# Altium schematic sheet power_REG104GA_3V3.SchDoc
size A4
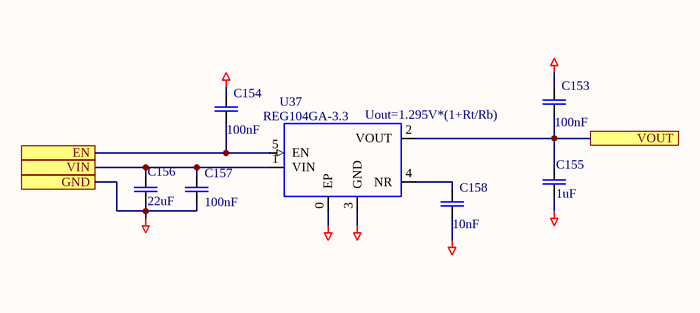
[diagram p0: power_REG104GA_3V3.SchDoc]

## Parts
C153  100nF  [CAPC1608N]
C154  100nF  [CAPC1608N]
C155  1uF  [CAPC2012N]
C156  22uF  [CAPC2012N]
C157  100nF  [CAPC1608N]
C158  10nF  [CAPC1608N]
U37  REG104GA-3.3  [SOT223]

## Ports
EN, GND, VIN, VOUT

## Nets
GND: C153.2 C154.2 C155.1 C156.1 C157.1 C158.1 U37.0(EP) U37.3(GND) ; port GND
EN: C154.1 U37.5(EN) ; port EN
VIN: C156.2 C157.2 U37.1(VIN) ; port VIN
VOUT: C153.1 C155.2 U37.2(VOUT) ; port VOUT
NetC158_2: C158.2 U37.4(NR)

## Notes on the sheet
- (near U37) Uout=1.295V*(1+Rt/Rb)

## Library data of the parts
C153 C154 C157 C158 = CAPC: Generic ceramic SMD capacitor; Pkg: 0603; Maintainer: Evgeniy Kotov; SMD Solders: 2; THD Solders: 0; Last Change Data: 06.03.2017; Release Date: 06.03.2017
  C153 C154 C157: PartField: 100nF; Value: 100nF
  C158: PartField: 10nF; Value: 10nF
C155 C156 = CAPC: Generic ceramic SMD capacitor; Pkg: 0805; Maintainer: Evgeniy Kotov; SMD Solders: 2; THD Solders: 0; Voltage Rating: 10V; Last Change Data: 06.03.2017; Release Date: 06.03.2017
  C155: PartField: 1uF; Value: 1uF
  C156: PartField: 22uF; Value: 22uF
U37 = REG104GA-3.3: Single Output LDO, 1.0A, Fixed (3.3V), Low Noise, Fast Transient Response; Manufacturer: Texas Instruments; Manufacturer_Part_Number: reg104-33_dcq_6; INDUSTRY_STD_PKG_TYPE: SOT-223; FAMILY_NAME: SINGLE CHANNEL LDO; PIN_COUNT: 6; PACKAGE_DESIGNATOR: DCQ; Pkg: SOT-5EP; THD Solders: 0; Value: REG104GA-3.3; Datasheet URL: http://www.ti.com/lit/gpn/REG104-A; GENERIC_PART_NUMBER: REG104GA-3.3; Vendor: Texas Instruments; SMD Solders: 6; PartField: REG104GA-3.3